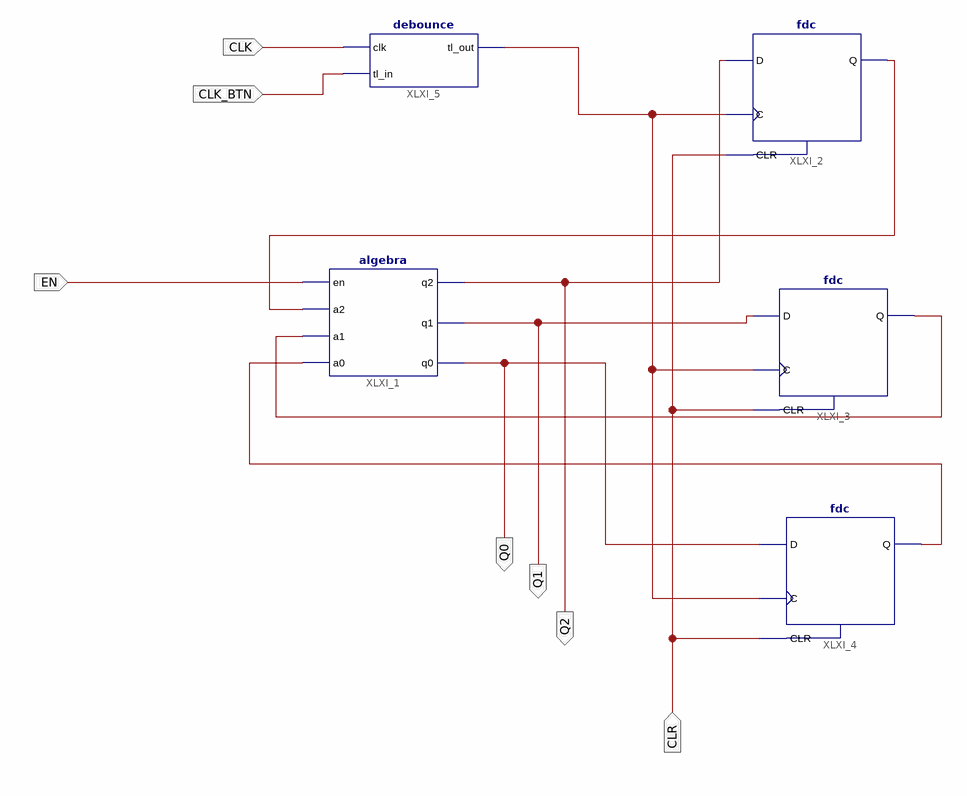
[diagram p0: schematic sheet 1]
// Xilinx ISE schematic modulo6.sch (spartan3e) as structural Verilog: 5 symbols, 7 ports
module modulo6 (
  input  EN,
  input  CLR,
  input  CLK,
  input  CLK_BTN,
  output Q2,
  output Q1,
  output Q0
);

  wire XLXN_4, XLXN_25, XLXN_26, XLXN_30;

  algebra XLXI_1 (.en(EN), .a2(XLXN_4), .a1(XLXN_25), .a0(XLXN_26), .q2(Q2), .q1(Q1), .q0(Q0));
  fdc XLXI_2 (.C(XLXN_30), .CLR(CLR), .D(Q2), .Q(XLXN_4));
  fdc XLXI_3 (.C(XLXN_30), .CLR(CLR), .D(Q1), .Q(XLXN_25));
  fdc XLXI_4 (.C(XLXN_30), .CLR(CLR), .D(Q0), .Q(XLXN_26));
  debounce XLXI_5 (.clk(CLK), .tl_in(CLK_BTN), .tl_out(XLXN_30));
endmodule
